# EAGLE schematic eagle65brdfile (EAGLE 6.5.0)
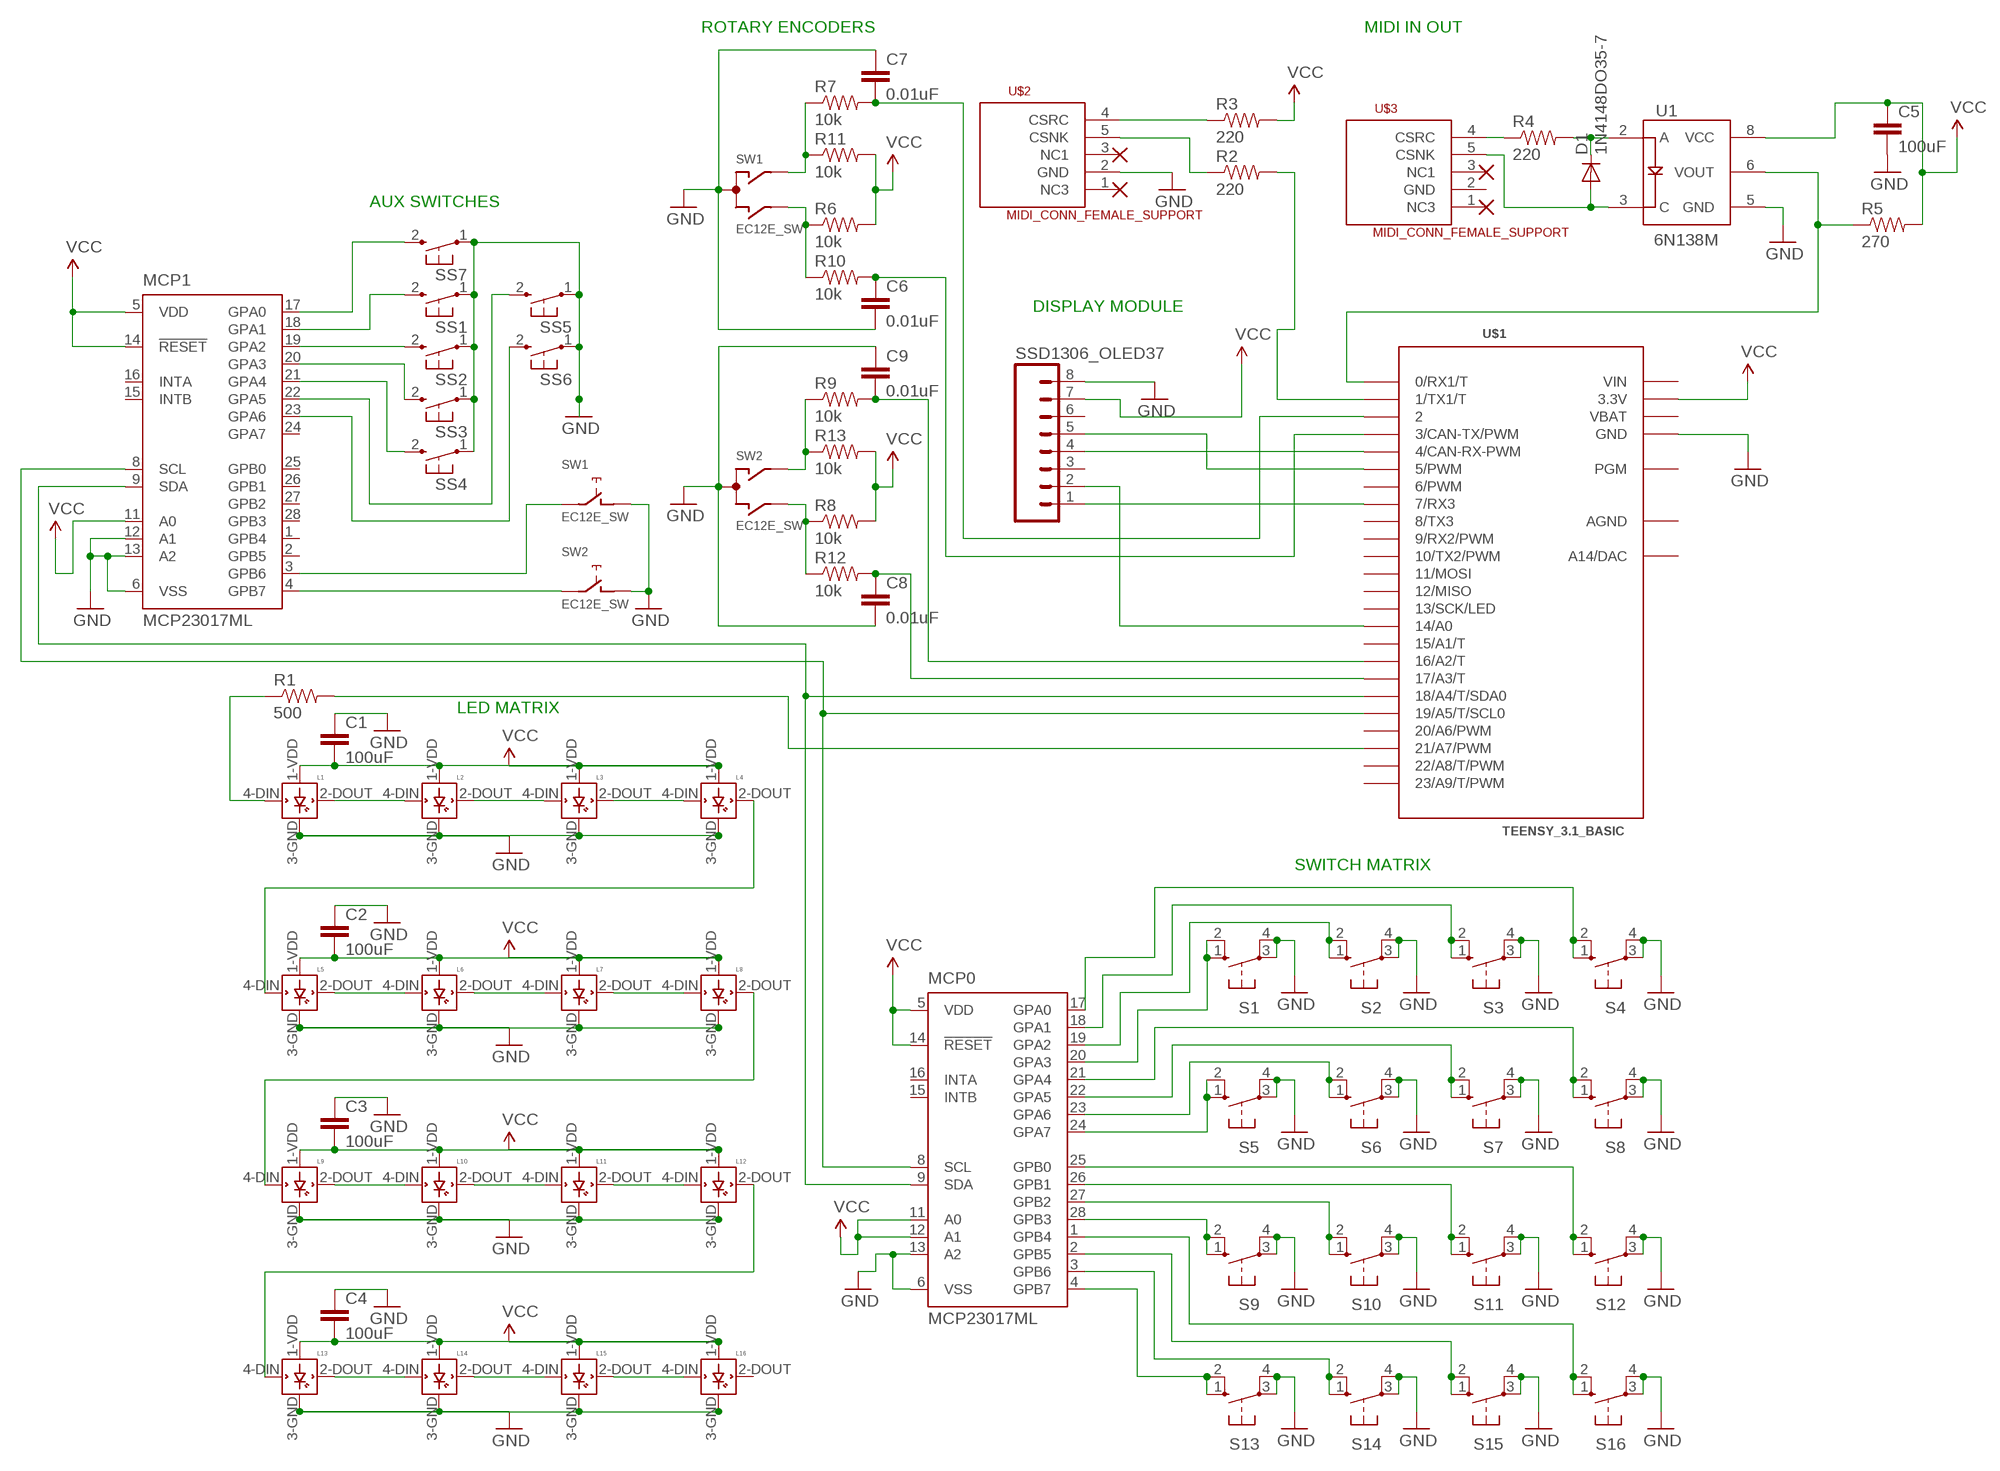
[diagram p0: schematic, sheet 1]

## Parts
C1  100uF  1.0UF-25V-+80/-20(0805)  [0805]
C2  100uF  1.0UF-25V-+80/-20(0805)  [0805]
C3  100uF  1.0UF-25V-+80/-20(0805)  [0805]
C4  100uF  1.0UF-25V-+80/-20(0805)  [0805]
C5  100uF  1.0UF-25V-+80/-20(0805)  [0805]
C6  0.01uF  1.0UF-25V-+80/-20(0805)  [0805]
C7  0.01uF  1.0UF-25V-+80/-20(0805)  [0805]
C8  0.01uF  1.0UF-25V-+80/-20(0805)  [0805]
C9  0.01uF  1.0UF-25V-+80/-20(0805)  [0805]
D1  1N4148DO35-7  [DO35-7]
L1  WS2812B  [WS2812B]
L2  WS2812B  [WS2812B]
L3  WS2812B  [WS2812B]
L4  WS2812B  [WS2812B]
L5  WS2812B  [WS2812B]
L6  WS2812B  [WS2812B]
L7  WS2812B  [WS2812B]
L8  WS2812B  [WS2812B]
L9  WS2812B  [WS2812B]
L10  WS2812B  [WS2812B]
L11  WS2812B  [WS2812B]
L12  WS2812B  [WS2812B]
L13  WS2812B  [WS2812B]
L14  WS2812B  [WS2812B]
L15  WS2812B  [WS2812B]
L16  WS2812B  [WS2812B]
MCP0  MCP23017ML  [QFN28-ML_6X6MM]
MCP1  MCP23017ML  [QFN28-ML_6X6MM]
R1  500  RESISTOR0805-RES  [0805]
R2  220  RESISTOR0805-RES  [0805]
R3  220  RESISTOR0805-RES  [0805]
R4  220  RESISTOR0805-RES  [0805]
R5  270  RESISTOR0805-RES  [0805]
R6  10k  RESISTOR0805-RES  [0805]
R7  10k  RESISTOR0805-RES  [0805]
R8  10k  RESISTOR0805-RES  [0805]
R9  10k  RESISTOR0805-RES  [0805]
R10  10k  RESISTOR0805-RES  [0805]
R11  10k  RESISTOR0805-RES  [0805]
R12  10k  RESISTOR0805-RES  [0805]
R13  10k  RESISTOR0805-RES  [0805]
S1  10-XX  [B3F-10XX]
S2  10-XX  [B3F-10XX]
S3  10-XX  [B3F-10XX]
S4  10-XX  [B3F-10XX]
S5  10-XX  [B3F-10XX]
S6  10-XX  [B3F-10XX]
S7  10-XX  [B3F-10XX]
S8  10-XX  [B3F-10XX]
S9  10-XX  [B3F-10XX]
S10  10-XX  [B3F-10XX]
S11  10-XX  [B3F-10XX]
S12  10-XX  [B3F-10XX]
S13  10-XX  [B3F-10XX]
S14  10-XX  [B3F-10XX]
S15  10-XX  [B3F-10XX]
S16  10-XX  [B3F-10XX]
SS1  10-XX6MMSLIM  [B3F-10XX]
SS2  10-XX6MMSLIM  [B3F-10XX]
SS3  10-XX6MMSLIM  [B3F-10XX]
SS4  10-XX6MMSLIM  [B3F-10XX]
SS5  10-XX6MMSLIM  [B3F-10XX]
SS6  10-XX6MMSLIM  [B3F-10XX]
SS7  10-XX6MMSLIM  [B3F-10XX]
SSD1306_OLED37  M08  [1X08_ROUND]
SW1  EC12E_SW  [ALPS_EC12E_SW]
SW2  EC12E_SW  [ALPS_EC12E_SW]
U1  6N138M  OPTO_DARL_6N138S  [8-SMD]
U$1  TEENSY_3.1_BASIC  [TEENSY_3.1_BASIC]
U$2  MIDI_CONN_FEMALE_SUPPORT  [DIN_5_FEMALE_SUPPORT]
U$3  MIDI_CONN_FEMALE_SUPPORT  [DIN_5_FEMALE_SUPPORT]

## Nets
GND: C1.1 C2.1 C3.1 C4.1 C5.2 C6.2 C7.1 C8.2 C9.1 L1.3-GND(GND) L2.3-GND(GND) L3.3-GND(GND) L4.3-GND(GND) L5.3-GND(GND) L6.3-GND(GND) L7.3-GND(GND) L8.3-GND(GND) L9.3-GND(GND) L10.3-GND(GND) L11.3-GND(GND) L12.3-GND(GND) L13.3-GND(GND) L14.3-GND(GND) L15.3-GND(GND) L16.3-GND(GND) MCP0.6(VSS) MCP0.13(A2) MCP1.6(VSS) MCP1.12(A1) MCP1.13(A2) S1.3(P) S1.4(P1) S2.3(P) S2.4(P1) S3.3(P) S3.4(P1) S4.3(P) S4.4(P1) S5.3(P) S5.4(P1) S6.3(P) S6.4(P1) S7.3(P) S7.4(P1) S8.3(P) S8.4(P1) S9.3(P) S9.4(P1) S10.3(P) S10.4(P1) S11.3(P) S11.4(P1) S12.3(P) S12.4(P1) S13.3(P) S13.4(P1) S14.3(P) S14.4(P1) S15.3(P) S15.4(P1) S16.3(P) S16.4(P1) SS1.1 SS2.1 SS3.1 SS4.1 SS5.1 SS6.1 SS7.1 SSD1306_OLED37.8 SW1.C SW1.D SW2.C SW2.D U1.5(GND) U$1.GND U$1.GND1(GND) U$2.2(GND)
N$1: L1.2-DOUT(DOUT) L2.4-DIN(DIN)
N$2: L2.2-DOUT(DOUT) L3.4-DIN(DIN)
N$3: L3.2-DOUT(DOUT) L4.4-DIN(DIN)
N$4: L5.2-DOUT(DOUT) L6.4-DIN(DIN)
N$5: L6.2-DOUT(DOUT) L7.4-DIN(DIN)
N$6: L7.2-DOUT(DOUT) L8.4-DIN(DIN)
N$7: L9.2-DOUT(DOUT) L10.4-DIN(DIN)
N$8: L10.2-DOUT(DOUT) L11.4-DIN(DIN)
N$9: L11.2-DOUT(DOUT) L12.4-DIN(DIN)
N$10: L13.2-DOUT(DOUT) L14.4-DIN(DIN)
N$11: L14.2-DOUT(DOUT) L15.4-DIN(DIN)
N$12: L15.2-DOUT(DOUT) L16.4-DIN(DIN)
N$13: L4.2-DOUT(DOUT) L5.4-DIN(DIN)
N$14: R2.1 U$2.5(CSNK)
N$15: R2.2 U$1.1(1/TX1/T)
N$16: MCP0.20(GPA3) S1.1(S) S1.2(S1)
N$17: MCP0.19(GPA2) S2.1(S) S2.2(S1)
N$18: MCP0.18(GPA1) S3.1(S) S3.2(S1)
N$19: MCP0.17(GPA0) S4.1(S) S4.2(S1)
N$20: R1.2 U$1.21/A7(21/A7/PWM)
N$21: MCP0.24(GPA7) S5.1(S) S5.2(S1)
N$22: MCP0.23(GPA6) S6.1(S) S6.2(S1)
N$23: MCP0.22(GPA5) S7.1(S) S7.2(S1)
N$24: MCP0.21(GPA4) S8.1(S) S8.2(S1)
N$25: MCP0.28(GPB3) S9.1(S) S9.2(S1)
N$26: MCP0.27(GPB2) S10.1(S) S10.2(S1)
N$27: MCP0.26(GPB1) S11.1(S) S11.2(S1)
N$28: MCP0.25(GPB0) S12.1(S) S12.2(S1)
N$29: MCP0.4(GPB7) S13.1(S) S13.2(S1)
N$30: MCP0.3(GPB6) S14.1(S) S14.2(S1)
N$31: MCP0.2(GPB5) S15.1(S) S15.2(S1)
N$32: MCP0.1(GPB4) S16.1(S) S16.2(S1)
N$33: MCP0.8(SCL) MCP1.8(SCL) U$1.19/A5(19/A5/T/SCL0)
N$34: MCP0.9(SDA) MCP1.9(SDA) U$1.18/A4(18/A4/T/SDA0)
N$35: SSD1306_OLED37.1 U$1.7(7/RX3)
N$36: SSD1306_OLED37.2 U$1.14/A0
N$37: SSD1306_OLED37.4 U$1.4(4/CAN-RX-PWM)
N$38: SSD1306_OLED37.5 U$1.5(5/PWM)
N$39: L12.2-DOUT(DOUT) L13.4-DIN(DIN)
N$40: R3.1 U$2.4(CSRC)
N$41: R8.1 R12.1 SW2.B
N$42: R9.1 R13.1 SW2.A
N$45: MCP1.4(GPB7) SW2.E
N$46: MCP1.3(GPB6) SW1.E
N$47: MCP1.17(GPA0) SS7.2(S1)
N$48: MCP1.18(GPA1) SS1.2(S1)
N$49: MCP1.19(GPA2) SS2.2(S1)
N$50: MCP1.23(GPA6) SS6.2(S1)
N$51: MCP1.22(GPA5) SS5.2(S1)
N$52: MCP1.20(GPA3) SS3.2(S1)
N$53: MCP1.21(GPA4) SS4.2(S1)
N$54: L1.4-DIN(DIN) R1.1
N$55: L8.2-DOUT(DOUT) L9.4-DIN(DIN)
N$56: R4.1 U$3.4(CSRC)
N$57: D1.C R4.2 U1.2(A)
N$58: D1.A U1.3(C) U$3.5(CSNK)
N$59: R5.1 U1.6(VOUT) U$1.0(0/RX1/T)
N$60: C6.1 R10.2 U$1.3(3/CAN-TX/PWM)
N$61: R6.1 R10.1 SW1.B
N$62: R7.1 R11.1 SW1.A
N$63: C7.2 R7.2 U$1.2
N$64: C8.1 R12.2 U$1.17/A3(17/A3/T)
N$65: C9.2 R9.2 U$1.16/A2(16/A2/T)
VCC: C1.2 C2.2 C3.2 C4.2 C5.1 L1.1-VDD(VDD) L2.1-VDD(VDD) L3.1-VDD(VDD) L4.1-VDD(VDD) L5.1-VDD(VDD) L6.1-VDD(VDD) L7.1-VDD(VDD) L8.1-VDD(VDD) L9.1-VDD(VDD) L10.1-VDD(VDD) L11.1-VDD(VDD) L12.1-VDD(VDD) L13.1-VDD(VDD) L14.1-VDD(VDD) L15.1-VDD(VDD) L16.1-VDD(VDD) MCP0.5(VDD) MCP0.11(A0) MCP0.12(A1) MCP0.14(!RESET) MCP1.5(VDD) MCP1.11(A0) MCP1.14(!RESET) R3.2 R5.2 R6.2 R8.2 R11.2 R13.2 SSD1306_OLED37.7 U1.8(VCC) U$1.3.3V U$1.3.3V1(3.3V)
Unconnected: L16.2-DOUT(DOUT) MCP0.15(INTB) MCP0.16(INTA) MCP1.1(GPB4) MCP1.2(GPB5) MCP1.15(INTB) MCP1.16(INTA) MCP1.24(GPA7) MCP1.25(GPB0) MCP1.26(GPB1) MCP1.27(GPB2) MCP1.28(GPB3) SSD1306_OLED37.3 SSD1306_OLED37.6 SW1.GND1(G) SW1.GND2(G) SW2.GND1(G) SW2.GND2(G) U$1.6(6/PWM) U$1.8(8/TX3) U$1.9(9/RX2/PWM) U$1.10(10/TX2/PWM) U$1.11(11/MOSI) U$1.12(12/MISO) U$1.13(13/SCK/LED) U$1.15/A1(15/A1/T) U$1.20/A6(20/A6/PWM) U$1.22/A8(22/A8/T/PWM) U$1.23/A9(23/A9/T/PWM) U$1.A14(A14/DAC) U$1.PGM U$2.1(NC3) U$2.3(NC1) U$3.1(NC3) U$3.2(GND) U$3.3(NC1)

## Notes on the sheet
- ROTARY ENCODERS | MIDI IN OUT
- AUX SWITCHES
- DISPLAY MODULE
- LED MATRIX
- SWITCH MATRIX

## Power pins joined to a net without a drawn wire
AGND: U$1.AGND
VBAT: U$1.VBAT
VIN: U$1.VIN

## Library data of the parts
C1-C9 = SparkFun-Capacitors:1.0UF-25V-+80/-20(0805): CAP-11625; PROD_ID: CAP-11625; VALUE: 1.0uF
D1 = diode:1N4148: DIODE high speed (Philips)
L1-L16 = adafruit:WS2812B
MCP0 MCP1 = microchip:MCP23017: http://ww1.microchip.com/downloads/en/DeviceDoc/21952a.pdf Source: http://ww1.microchip.com/downloads/en/DeviceDoc/21952a.pdf; MF: MICROCHIP; MPN: MCP23017-E/ML; OC_FARNELL: unknown; OC_NEWARK: 31K2957
R1-R13 = SparkFun-Passives:RESISTOR: Resistor Basic schematic elements and footprints for 0603, 1206, and PTH resistors.
S1-S16 = switch-omron:10-XX: OMRON SWITCH; MPN: B3F-1000; OC_FARNELL: 176432; OC_NEWARK: 36M3542
SS1-SS7 = TenkaiLibrary:10-XX: OMRON SWITCH
SSD1306_OLED37 = SparkFun-Connectors:M08: Header 8 Standard 8-pin 0.1" header. Use with straight break away headers (SKU : PRT-00116), right angle break away headers (PRT-00553), swiss pins (PRT-00743), machine pins (PRT-00117), and female headers (PRT-00115).
SW1 SW2 = switch-alps:EC12E_SW: ALPS rotary Encoder EC12E series with switch; MPN: EC12E2424407; OC_FARNELL: 1520813; OC_NEWARK: 74M1068
U1 = SparkFun-DiscreteSemi:OPTO_DARL_6N138S: Optoisolator, darlington pair output; PROD_ID: IC-09482
U$1 = Teensy_3_Series_Board_v1.0:TEENSY_3.1_BASIC: Footprint for Teensy 3.1 board using all pin connections on the outer perimeter
U$2 U$3 = SparkFun-Connectors:MIDI_CONN_FEMALE_SUPPORT: MIDI connector with strain relief (DIN-5 female)